# EasyEDA Pro project capDisChg_v1.eprj

# Schematic Schematic1
Board Name: Board1; Create Date: 2024-09-26
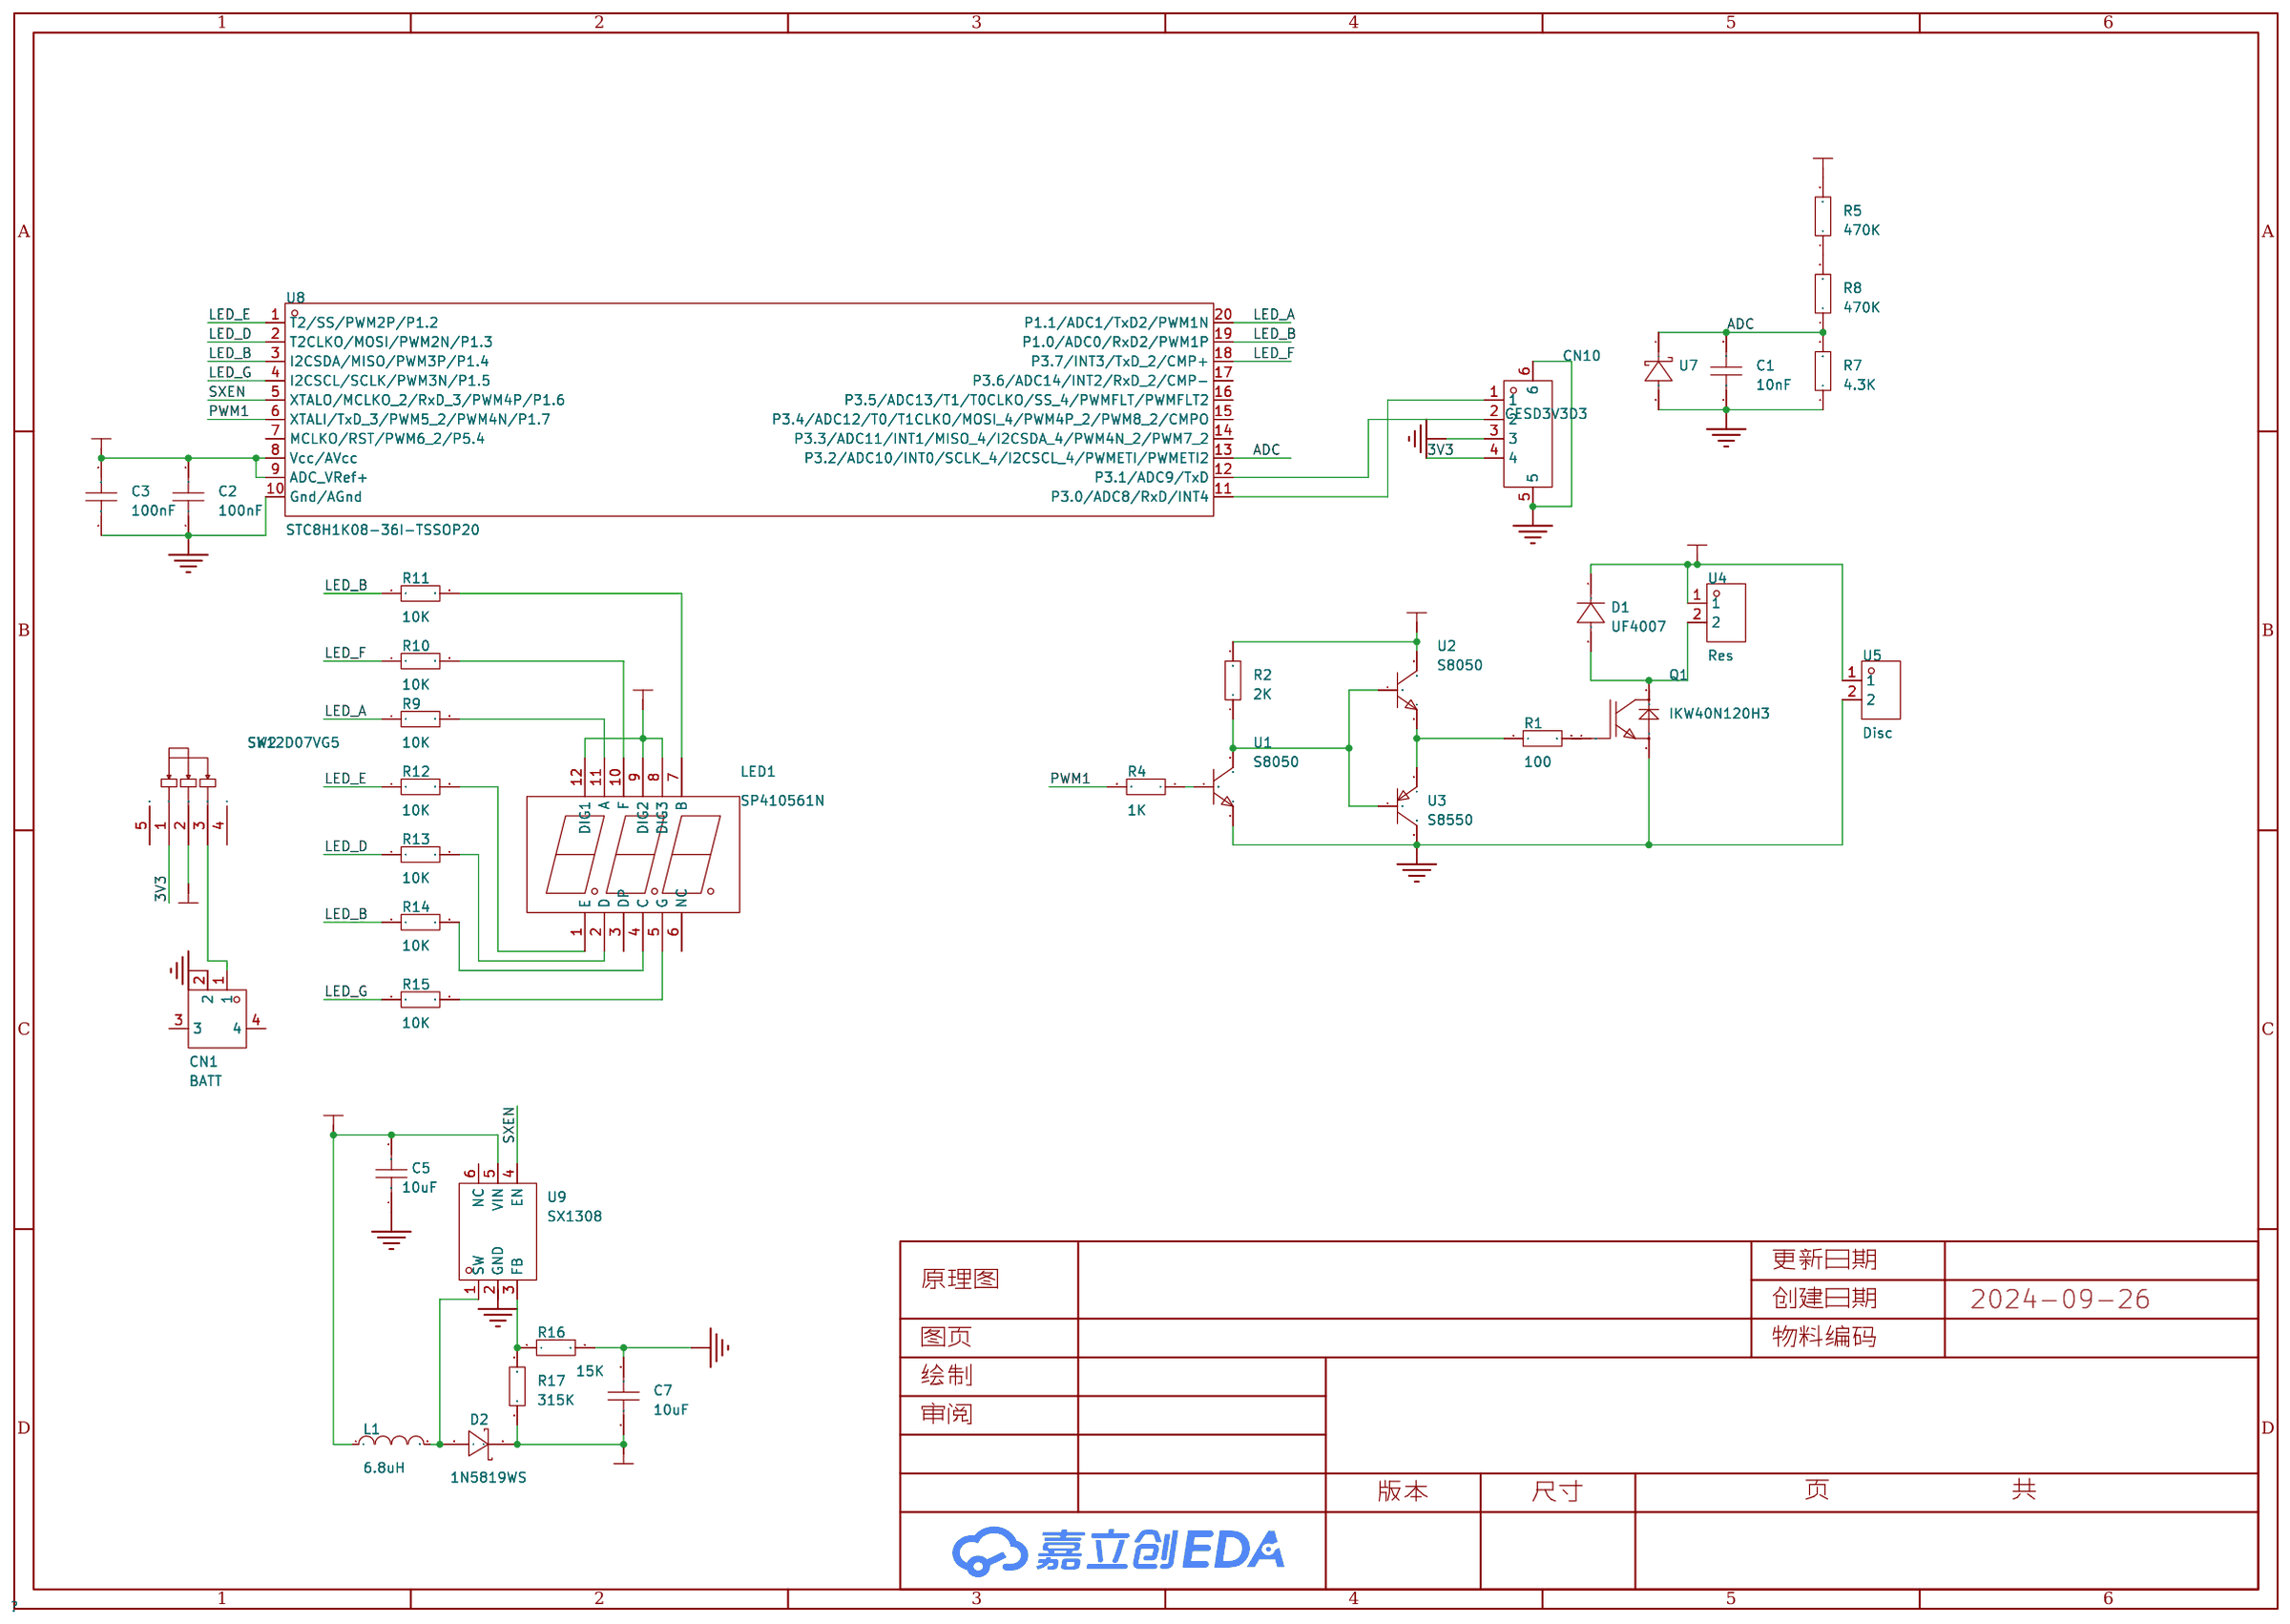
[diagram p0: schematic sheet]

## Parts
C1  10nF  [C0603]
C2  100nF  [C0603]
C3  100nF  [C0603]
C5  10uF  [C0603]
C7  10uF  [C0805]
CN1  BATT  [CONN-TH_2P-P1.25_XUNPU_WAFER-GH1.25-2PWB]
CN10  WAFER-GH1.25-4PLB  [CONN-SMD_4P-P1.25_XUNPU_WAFER-GH1.25-4PLB]
D1  UF4007  [DO-41_BD2.4-L4.7-P8.70-D0.9-RD]
D2  1N5819WS  [SOD-323_L1.8-W1.3-LS2.5-RD]
L1  6.8uH  [L1206]
LED1  SP410561N  [LED-SEG-TH_12P-L37.6-W19.0-P2.54-S15.24-BL]
Q1  IKW40N120H3  [TO-247AC-3_L15.8-W5.0-P5.46-L]
R1  100  [R0603]
R2  2K  [R0603]
R4  1K  [R0603]
R5  470K  [resis_1W_ZC_LC]
R7  4.3K  [R0603]
R8  470K  [resis_1W_ZC_LC]
R9  10K  [R0603]
R10  10K  [R0603]
R11  10K  [R0603]
R12  10K  [R0603]
R13  10K  [R0603]
R14  10K  [R0603]
R15  10K  [R0603]
R16  15K  [R0603]
R17  315K  [R0603]
SW2  SK12D07VG5  [SW-TH_SK12D07VG5]
U1  S8050  [SOT-23-3_L2.9-W1.3-P1.90-LS2.3-BR]
U2  S8050  [SOT-23-3_L2.9-W1.3-P1.90-LS2.3-BR]
U3  S8550  [SOT-23-3_L2.9-W1.3-P1.90-LS2.4-BR]
U4  Res  [CONN-TH_VH3.96-3A2]
U5  Disc  [CONN-TH_VH3.96-3A2]
U7  CESD3V3D3  [SOD-523_L1.2-W0.8-LS1.6-RD]
U8  STC8H1K08-36I-TSSOP20  [TSSOP-20_L6.5-W4.4-P0.65-LS6.4-BL]
U9  SX1308  [SOT-23-6_L2.9-W1.6-P0.95-LS2.8-BL]

## Library data of the parts
C1-C3 C5 = CAP_0603: Supplier Footprint: 0603
C7 = CAP_0805: Supplier Footprint: 0805
CN1 = WAFER-GH1.25-2PWB: LCSC Part Name: 1x2P 间距:1.25mm 卧贴 系列:GH; Supplier Part: C3029377; Manufacturer: XUNPU(讯普); Supplier Footprint: SMD,P=1.25mm,卧贴; JLCPCB Part Class: 扩展库; Datasheet: https://atta.szlcsc.com/upload/public/pdf/source/20220527/CB8773BFB0913C3B8ABD62CB38BA101A.pdf; Supplier: LCSC; Pins Structure: 1x2P; Pitch: 1.25mm; Mounting Style: 卧贴; Reference Series: GH; Number of Pins: 2P; Number of Rows: 1; Number of PINs Per Row: 2; Current Rating (Max): 1A; Operating Temperature Range: -25℃~+85℃
CN10 = WAFER-GH1.25-4PLB: LCSC Part Name: 1x4P 间距:1.25mm 立贴 系列:GH; Supplier Part: C3029370; Manufacturer: XUNPU(讯普); Supplier Footprint: SMD,P=1.25mm; JLCPCB Part Class: Extended Part; Datasheet: https://atta.szlcsc.com/upload/public/pdf/source/20220527/44F824AAC8C2B617205E15955FF9C23D.pdf; Supplier: LCSC; Pins Structure: 1x4P; Pitch: 1.25mm; Mounting Style: 立贴; Reference Series: GH; Number of Pins: 4P; Number of Rows: 1; Number of PINs Per Row: 4; Current Rating (Max): 1A; Operating Temperature Range: -25℃~+85℃
D1 = UF4007_C960666: LCSC Part Name: 电压:1kV 电流:1A; Supplier Part: C960666; Manufacturer: MDD(辰达半导体); Supplier Footprint: DO-41; JLCPCB Part Class: 扩展库; Datasheet: https://atta.szlcsc.com/upload/public/pdf/source/20230823/1B30A65DCB3ACA14005A2F03886CEF7C.pdf; Supplier: LCSC; Forward Voltage (Vf@If): 1.7V@1A; Reverse Voltage (Vr): 1kV; Rectified Current: 1A; Reverse Leakage Current: 5uA@1kV; Reverse Recovery Time (trr): 75ns; Operating Temperature: -50℃~+150℃@(Tj)
D2 = 1N5819WS_C191023: LCSC Part Name: 电压:40V 电流:1A; Supplier Part: C191023; Manufacturer: Hottech(合科泰); Supplier Footprint: SOD-323; JLCPCB Part Class: Basic Part; Datasheet: https://atta.szlcsc.com/upload/public/pdf/source/20220428/3CB86FD8D28D653594B4E35F9D5AEFD9.pdf; Supplier: LCSC; Forward Voltage (Vf@If): 600mV@1A; Reverse Voltage (Vr): 40V; Average Rectified Current (Io): 1A
L1 = L_1206
LED1 = SP410561N: LCSC Part Name: 3位0.56英寸红色数码管 共阳极; Supplier Part: C98924; Manufacturer: ARKLED(方舟); Supplier Footprint: 插件; JLCPCB Part Class: 扩展库; Datasheet: https://atta.szlcsc.com/upload/public/pdf/source/20180620/C98924_8B6F6D234E67B3F37673B777B8AFD976.pdf; Supplier: LCSC; Number of Characters: 3位; Luminous Color: 红色; LED Polarity: 共阳极; Digit/Alpha Size(inch): 0.56
Q1 = IKW40N120H3: Supplier Part: C94637; Manufacturer: Infineon(英飞凌); Supplier Footprint: TO-247AC-3; JLCPCB Part Class: Extended Part; Datasheet: https://atta.szlcsc.com/upload/public/pdf/source/20170211/1486806283981.pdf; Supplier: LCSC
R1 R2 R4 R5 R7-R17 = Res_0603: Supplier Footprint: 0603
SW2 = SK12D07VG5: LCSC Part Name: 两档位卧式拨动开关,柄长5MM; Supplier Part: C431548; Manufacturer: SHOU HAN(首韩); Supplier Footprint: 插件; JLCPCB Part Class: 扩展库; Datasheet: https://atta.szlcsc.com/upload/public/pdf/source/20190925/C431548_D6571AEBDE139FDB1E6F8A4B1513A630.pdf; Supplier: LCSC; Circuit: 单刀双掷; Pin Style: PC引脚; Switch Length: 8.7mm; Switch Width: 4.4mm; Switch Height: 4.7mm; Mounting Style: 侧插; Current Rating (DC): 500mA; Voltage Rating (DC): 50V; Mechanical Life: 5千次; Operating Temperature: -10℃~+50℃
U1 U2 = S8050_C20069125: LCSC Part Name: NPN 电流:500mA 耐压:25V; Supplier Part: C20069125; Manufacturer: 宏迦橙; Supplier Footprint: SOT-23; JLCPCB Part Class: 扩展库; Datasheet: https://atta.szlcsc.com/upload/public/pdf/source/20240403/2D78449C96B6E27F13BF8BDF79E27159.pdf; Supplier: LCSC; Transistor Type: NPN; Collector Current (Ic): 500mA; Collector-Emitter Breakdown Voltage (Vceo): 25V; Power Dissipation (Pd): 300mW; DC Current Gain (hFE@Ic,Vce): 120@50mA,1.0V; Transition Frequency (fT): 100MHz; Collector Cut-Off Current (Icbo): 100nA; Collector-Emitter Saturation Voltage (VCE(sat)@Ic,Ib): 600mV@500mA,50mA; Operating Temperature: -55℃~+150℃
U3 = S8550_C20069126: LCSC Part Name: PNP 电流:500mA 耐压:25V; Supplier Part: C20069126; Manufacturer: 宏迦橙; Supplier Footprint: SOT-23; JLCPCB Part Class: Extended Part; Datasheet: https://atta.szlcsc.com/upload/public/pdf/source/20231229/A44F382554E15234B24C32D7C3971EED.pdf; Supplier: LCSC; Transistor Type: PNP; Collector Current (Ic): 500mA; Collector-Emitter Breakdown Voltage (Vceo): 25V; Power Dissipation (Pd): 300mW; DC Current Gain (hFE@Ic,Vce): 120@500mA,1.0V; Transition Frequency (fT): 150MHz; Collector Cut-Off Current (Icbo): 100nA; Collector-Emitter Saturation Voltage (VCE(sat)@Ic,Ib): 500mV@1.0A,50mA; Operating Temperature: -55℃~+150℃
U4 U5 = VH3.96-3P(2P) ZZ: LCSC Part Name: 1x3P 间距:3.96mm 直插 系列:VH; Supplier Part: C5884431; Manufacturer: SHOU HAN(首韩); Supplier Footprint: 插件,P=3.96mm; JLCPCB Part Class: 扩展库; Datasheet: https://atta.szlcsc.com/upload/public/pdf/source/20230506/E8E7E8C8F22F3A8211E3BB95A79C703A.pdf; Supplier: LCSC; Pins Structure: 1x3P; Pitch: 3.96mm; Mounting Style: 直插; Reference Series: VH; Number of Pins: 3P; Number of Rows: 1; Number of PINs Per Row: 3; Row Spacing: 3.96mm; Current Rating (Max): 7A; Contact Material: 黄铜; Contact Plating: 锡; Operating Temperature Range: -25℃~+85℃
U7 = CESD3V3D3: Supplier Part: C20611855; Manufacturer: TECH PUBLIC(台舟); Supplier Footprint: SOD-523; JLCPCB Part Class: 扩展库; Datasheet: https://atta.szlcsc.com/upload/public/pdf/source/20240202/14995538BD672E25ECFCF906B3A58F3F.pdf; Supplier: LCSC
U8 = STC8H1K08-36I-TSSOP20: LCSC Part Name: 宽电压/高速/高可靠/低功耗/强抗静电/较强抗干扰的新一代 8051 单片机; Supplier Part: C915673; Manufacturer: STC(宏晶); Supplier Footprint: TSSOP-20; JLCPCB Part Class: 扩展库; Datasheet: https://atta.szlcsc.com/upload/public/pdf/source/20230914/FE7F6A67FEB4E2D9A560A799C5B97078.pdf; Supplier: LCSC; CPU Core: 51系列; Program Storage Size: 8KB; RAM Size: 1.25KB; GPIO Ports Number: 17; Operating Voltage Range: 1.9V~5.5V; Program Memory Type: FLASH; Operating Temperature Range: -40℃~+85℃; ADC (Bit): 10bit; PWM (Bit): 16bit; 16Bit Timer: 3; UART/USART: 2; I2C: 1; SPI: 1; Internal Comparator: 有; Peripheral/Function: 低电压检测；看门狗；CCP捕获/比较; Watchdog: 有; Low-Voltage Detect: 有; CCP Capture/Compare: 有
U9 = SX1308: Supplier Part: C78162; Manufacturer: SX(硕芯科技); Supplier Footprint: SOT-23-6; JLCPCB Part Class: Extended Part; Datasheet: https://atta.szlcsc.com/upload/public/pdf/source/20160920/1474356679185.pdf; Supplier: LCSC; Function: 升压型; Input Voltage: 2V~24V; Output Voltage: 28V; Switching Frequency: 1.2MHz; Synchronous Rectification: 否; Number of Outputs: 1; Topology: 升压式; Switch tube (built-in/external): 内置

## Nets
3V3: CN10.4 SW2.1
+12V: C7.1 D2.1(K) R2.2 R17.1 U2.3(C)
GND: C1.1 C2.1 C3.1 C5.1 C7.2 CN1.2 CN10.3 CN10.5 CN10.6 Q1.3(E) R7.1 R16.2 U1.2(E) U3.3(C) U5.2 U7.2 U8.10(Gnd/AGnd) U9.2(GND)
VBUS+: D1.1(K) R5.2 U4.1 U5.1
ADC: C1.2 R7.2 R8.1 U7.1 U8.13(P3.2/ADC10/INT0/SCLK_4/I2CSCL_4/PWMETI/PWMETI2)
LED_A: R9.1 U8.20(P1.1/ADC1/TxD2/PWM1N)
LED_B: R11.1 R14.1 U8.3(I2CSDA/MISO/PWM3P/P1.4) U8.19(P1.0/ADC0/RxD2/PWM1P)
LED_D: R13.1 U8.2(T2CLKO/MOSI/PWM2N/P1.3)
LED_E: R12.1 U8.1(T2/SS/PWM2P/P1.2)
LED_F: R10.1 U8.18(P3.7/INT3/TxD_2/CMP+)
LED_G: R15.1 U8.4(I2CSCL/SCLK/PWM3N/P1.5)
MCU_VCC: C2.2 C3.2 C5.2 L1.1 LED1.8(DIG3) LED1.9(DIG2) LED1.12(DIG1) SW2.2 U8.8(Vcc/AVcc) U8.9(ADC_VRef+) U9.5(VIN)
PWM1: R4.2 U8.6(XTALI/TxD_3/PWM5_2/PWM4N/P1.7)
SXEN: U8.5(XTALO/MCLKO_2/RxD_3/PWM4P/P1.6) U9.4(EN)
$1N222: Q1.1(G) R1.2
$1N351: R2.1 U1.3(C) U2.1(B) U3.1(B)
$1N515: R1.1 U2.2(E) U3.2(E)
$1N653: R4.1 U1.1(B)
$1N827: D1.2(A) Q1.2(C) U4.2
$1N1439: R5.1 R8.2
$1N2495: LED1.11(A) R9.2
$1N2500: LED1.10(F) R10.2
$1N2506: LED1.7(B) R11.2
$1N2512: LED1.1(E) R12.2
$1N2518: LED1.2(D) R13.2
$1N2550: LED1.4(C) R14.2
$1N2580: LED1.5(G) R15.2
$1N3029: D2.2(A) L1.2 U9.1(SW)
$1N3151: R16.1 R17.2 U9.3(FB)
$1N3739: CN10.2 U8.12(P3.1/ADC9/TxD)
$1N3745: CN10.1 U8.11(P3.0/ADC8/RxD/INT4)
$1N4939: CN1.1 SW2.3

Not connected (* = marked no-connect by the designer): CN1 3 4; LED1 3(DP) 6(NC); SW2 4 5; U8 7(MCLKO/RST/PWM6_2/P5.4) 14(P3.3/ADC11/INT1/MISO_4/I2CSDA_4/PWM4N_2/PWM7_2) 15(P3.4/ADC12/T0/T1CLKO/MOSI_4/PWM4P_2/PWM8_2/CMPO) 16(P3.5/ADC13/T1/T0CLKO/SS_4/PWMFLT/PWMFLT2) 17(P3.6/ADC14/INT2/RxD_2/CMP-); U9 6(NC)

# Board PCB1
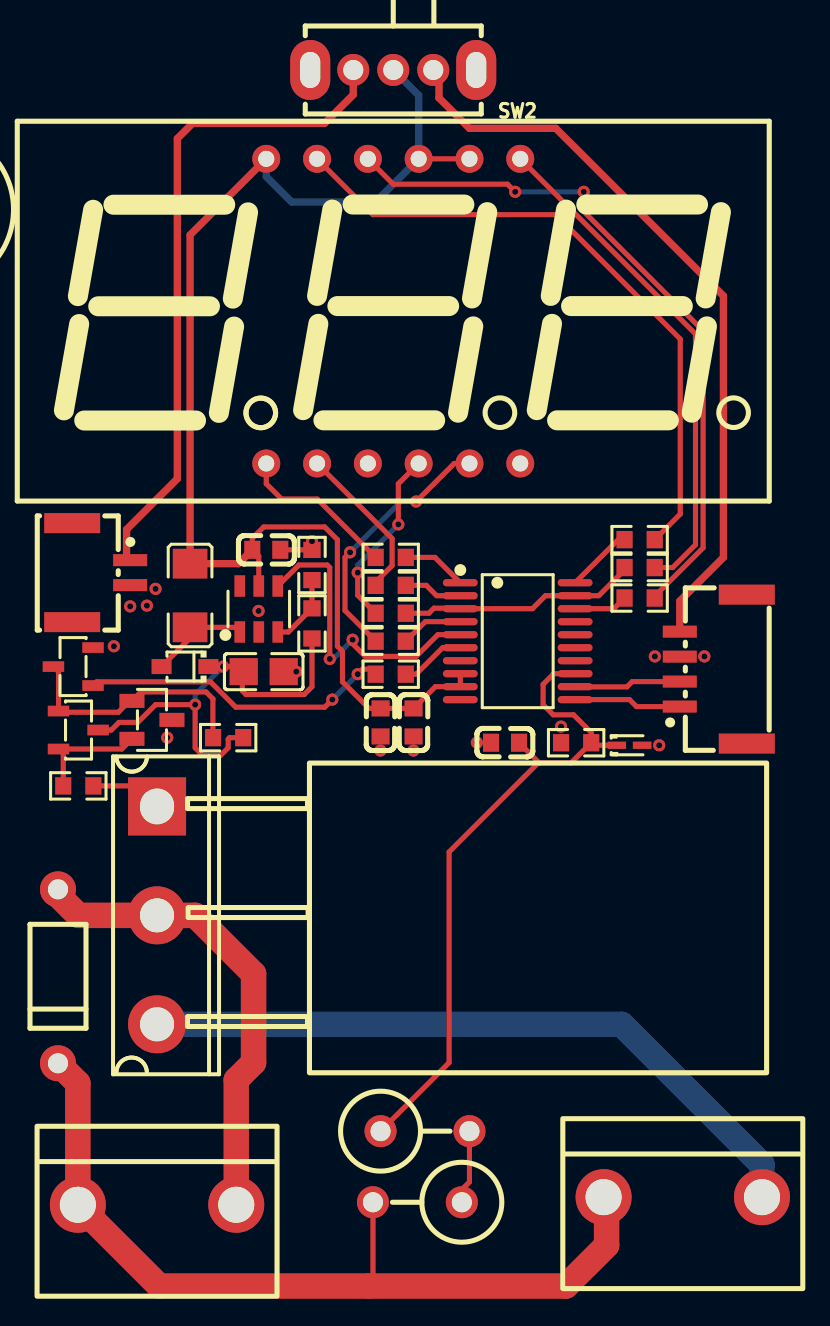
[diagram p1: board, top side]
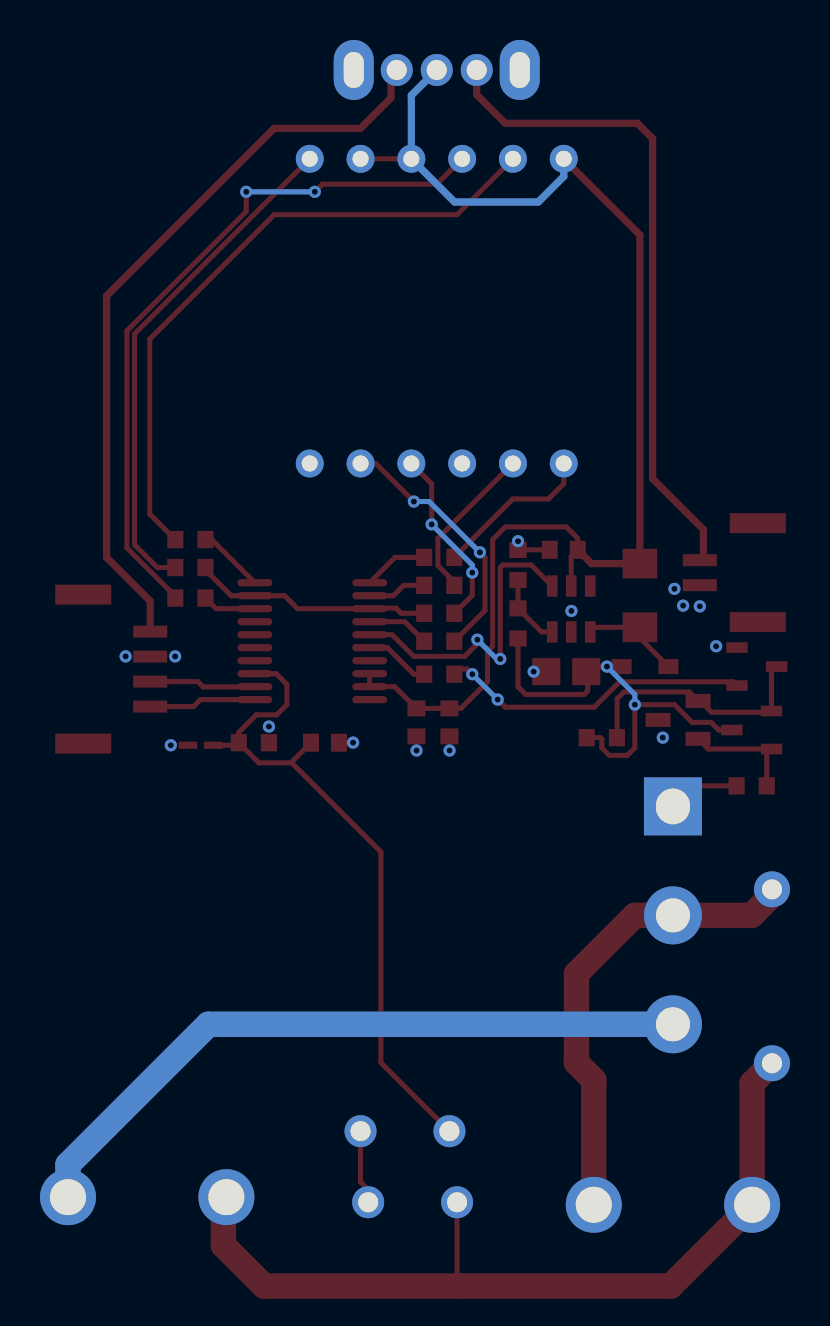
[diagram p2: board, bottom side, seen from below]

No outline. copper layers: Top Layer, Bottom Layer. Coordinates in mm from the lowest, leftmost part position.
Stack: Top Layer 0.035mm / Dielectric1 1.51mm FR4 er 4.5 / Bottom Layer 0.035mm

## Design rules (mm)
template: 自定义配置
spacing copperThickness1oz (default): track to track 0.127, other pairs 0.152 to 0.3
spacing copperThickness2oz: track to track 0.203, other pairs 0.152 to 0.3
track width copperThickness1oz (default): min 0.127, default 0.254, max 2.54
track width copperThickness2oz: min 0.203, default 0.254, max 2.54
differential pair differentialPair (default): width min 0.127, default 0.254, max 2.54; gap min 0.152, default 0.152
via viaSize (default): diameter min 0.5, default 0.61, max 10; hole min 0.3, default 0.305, max 6.3

## Placement (name value [footprint] x y rotation side)
C1  10nF  [C0603]  22.35 23.11 0 top
C2  100nF  [C0603]  16.13 24.13 90 top
C3  100nF  [C0603]  17.78 24.13 90 top
C5  10uF  [C0603]  10.41 32.77 180 top
C7  10uF  [C0805]  10.29 26.67 0 top
CN1  BATT  [CONN-TH_2P-P1.25_XUNPU_WAFER-GH1.25-2PWB]  2.16 31.62 270 top
CN10  WAFER-GH1.25-4PLB  [CONN-SMD_4P-P1.25_XUNPU_WAFER-GH1.25-4PLB]  32.77 26.8 90 top
D1  UF4007  [DO-41_BD2.4-L4.7-P8.70-D0.9-RD]  0 11.43 90 top
D2  1N5819WS  [SOD-323_L1.8-W1.3-LS2.5-RD]  6.35 26.92 180 top
L1  6.8uH  [L1206]  6.6 30.48 270 top
LED1  SP410561N  [LED-SEG-TH_12P-L37.6-W19.0-P2.54-S15.24-BL]  16.76 44.7 0 top
Q1  IKW40N120H3  [TO-247AC-3_L15.8-W5.0-P5.46-L]  4.95 14.48 270 top
R1  100  [R0603]  1.02 20.95 0 top
R2  2K  [R0603]  8.51 23.37 0 top
R4  1K  [R0603]  16.64 26.54 0 top
R5  470K  [resis_1W_ZC_LC]  20.19 0.13 180 top
R7  4.3K  [R0603]  25.91 23.11 0 top
R8  470K  [resis_1W_ZC_LC]  16.13 3.68 0 top
R9  10K  [R0603]  29.08 33.27 0 top
R10  10K  [R0603]  29.08 30.35 0 top
R11  10K  [R0603]  29.08 31.88 0 top
R12  10K  [R0603]  16.64 32.39 180 top
R13  10K  [R0603]  16.64 30.99 180 top
R14  10K  [R0603]  16.64 29.59 180 top
R15  10K  [R0603]  16.64 28.19 180 top
R16  15K  [R0603]  12.7 32 90 top
R17  315K  [R0603]  12.7 29.08 90 top
SW2  SK12D07VG5  [SW-TH_SK12D07VG5]  16.76 56.77 180 top
U1  S8050  [SOT-23-3_L2.9-W1.3-P1.90-LS2.3-BR]  0.76 26.92 0 top
U2  S8050  [SOT-23-3_L2.9-W1.3-P1.90-LS2.3-BR]  1.02 23.75 180 top
U3  S8550  [SOT-23-3_L2.9-W1.3-P1.90-LS2.4-BR]  4.7 24.26 180 top
U4  Res  [CONN-TH_VH3.96-3A2]  4.95 0 0 top
U5  Disc  [CONN-TH_VH3.96-3A2]  31.24 0.38 0 top
U7  CESD3V3D3  [SOD-523_L1.2-W0.8-LS1.6-RD]  28.57 22.99 0 top
U8  STC8H1K08-36I-TSSOP20  [TSSOP-20_L6.5-W4.4-P0.65-LS6.4-BL]  22.99 28.19 270 top
U9  SX1308  [SOT-23-6_L2.9-W1.6-P0.95-LS2.8-BL]  10.04 29.8 0 top

## Footprints (pads in the part's own frame, mm; a bottom-side part is the same pattern mirrored in y, then rotated)
C0603
  rect 0.8x0.9 smd: 1(-0.7,0) 2(0.7,0)
C0805
  rect 1.41x1.35 smd: 1(-1,0) 2(1,0)
CONN-SMD_4P-P1.25_XUNPU_WAFER-GH1.25-4PLB
  rect 0.6x1.7 smd: 1(-1.875,1.675) 2(-0.625,1.675) 3(0.625,1.675) 4(1.875,1.675)
  rect 1x2.8 smd: 5(-3.725,-1.675) 6(3.725,-1.675)
CONN-TH_2P-P1.25_XUNPU_WAFER-GH1.25-2PWB
  rect 0.6x1.7 smd: 1(-0.625,1.45) 2(0.625,1.45)
  rect 1x2.8 smd: 3(-2.475,-1.45) 4(2.475,-1.45)
CONN-TH_VH3.96-3A2
  round 2.8 hole 1.8: 1(-3.96,0) 2(3.96,0)
DO-41_BD2.4-L4.7-P8.70-D0.9-RD
  round 1.8 hole 1: 1(-4.35,0) 2(4.35,0)
L1206
  rect 1.485x1.728 smd: 1(-1.593,0) 2(1.593,0)
LED-SEG-TH_12P-L37.6-W19.0-P2.54-S15.24-BL
  round 1.4 hole 0.8: 1(-6.35,-7.62) 2(-3.81,-7.62) 3(-1.27,-7.62) 4(1.27,-7.62) 5(3.81,-7.62) 6(6.35,-7.62) 7(6.35,7.62) 8(3.81,7.62) 9(1.27,7.62) 10(-1.27,7.62) 11(-3.81,7.62) 12(-6.35,7.62)
R0603
  rect 0.806x0.864 smd: 1(-0.753,0) 2(0.753,0)
resis_1W_ZC_LC
  round 1.6 hole 1: 1(0,0) 2(4.445,0)
SOD-323_L1.8-W1.3-LS2.5-RD
  rect 1x0.75 smd: 1(-1.173,0) 2(1.173,0)
SOD-523_L1.2-W0.8-LS1.6-RD
  rect 0.93x0.36 smd: 1(-0.635,0) 2(0.635,0)
SOT-23-3_L2.9-W1.3-P1.90-LS2.3-BR
  rect 1.07x0.532 smd: 1(0.99,-0.95) 2(0.99,0.95) 3(-0.99,0)
SOT-23-3_L2.9-W1.3-P1.90-LS2.4-BR
  rect 1.25x0.7 smd: 1(1,-0.95) 2(1,0.95) 3(-1,0)
SOT-23-6_L2.9-W1.6-P0.95-LS2.8-BL
  rect 0.532x1.072 smd: 1(-0.95,-1.149) 2(0,-1.149) 3(0.95,-1.149) 4(0.95,1.149) 5(0,1.149) 6(-0.95,1.149)
SW-TH_SK12D07VG5
  oval 1.6x1.6 hole 1: 1(-2,0) 2(0,0) 3(2,0)
  oval 2x3 hole 1x1.8: 4(4.15,0) 5(-4.15,0)
TO-247AC-3_L15.8-W5.0-P5.46-L
  rect 2.9x2.9 hole 1.785x1.7: 1(-5.45,0)
  round 2.9 hole 1.7: 2(0,0) 3(5.45,0)
TSSOP-20_L6.5-W4.4-P0.65-LS6.4-BL
  oval 0.364x1.742 smd: 1(-2.925,-2.871) 2(-2.275,-2.871) 3(-1.625,-2.871) 4(-0.975,-2.871) 5(-0.325,-2.871) 6(0.325,-2.871) 7(0.975,-2.871) 8(1.625,-2.871) 9(2.275,-2.871) 10(2.925,-2.871) 11(2.925,2.871) 12(2.275,2.871) 13(1.625,2.871) 14(0.975,2.871) 15(0.325,2.871) 16(-0.325,2.871) 17(-0.975,2.871) 18(-1.625,2.871) 19(-2.275,2.871) 20(-2.925,2.871)

## Nets
As in the schematic.

Pads without a net: CN1 3 4; LED1 3 6; SW2 4 5; U8 7 14 15 16 17; U9 6

## Via types
v1: diameter 0.61, hole 0.305, Top Layer to Bottom Layer, 27 vias

## Routing (per net, layer and track width the routed paths; a pad name or vN(x,y) marks a point on that pad's centre or on a via; arc(x,y) is an arc through that point)
3V3: length 37.5
  Top Layer w0.363: CN10.4 31.09,30.2 33.27,32.39 33.27,45.47 24.89,53.85 20.57,53.85 19.05,55.37 19.05,56.48 SW2.1
+12V: length 22.2
  Top Layer w0.254: R17.1 12.7,25.92 12.31,25.53 9.4,25.53 9.22,25.71 9.22,26.6 C7.1 9.03,26.92 v1(8.25,26.92) D2.1 ; U2.3 2.67,23.75 3.05,24.13 3.99,24.13 4.88,25.02 v1(6.86,25.02) 6.86,22.86 7.24,22.48 8.13,22.48 8.51,22.86 8.51,23.3 8.58,23.37 R2.2
  Bottom Layer w0.254: v1(6.86,25.02) 6.86,25.53 v1(8.25,26.92)
GND: length 36.4
  Top Layer w0.254: C5.1 12.69,32.77 R16.2
  Bottom Layer w1.27: Q1.3 28.18,9.03 35.2,2.01 U5.2
  vias: v1(2.79,27.94) v1(3.61,29.94) v1(4.44,29.97) v1(4.88,30.81) v1(5.46,23.37) v1(10.03,29.71) v1(11.92,26.67) v1(12.7,33.2) v1(16.12,22.72) v1(17.77,22.72) v1(20.95,23.12) v1(25.15,23.92) v1(29.84,27.43) v1(30.06,22.99) v1(32.32,27.43)
VBUS+: length 43.8
  Top Layer w0.254: 15.75,0.76 15.75,-3.84 15.52,-4.06
  Top Layer w1.27: D1.1 0.99,6.09 U4.1 5.06,-4.06 25.4,-4.06 27.43,-2.03 27.43,0.23 U5.1
ADC: length 33.8
  Top Layer w0.254: R7.2 26.79,22.99 U7.1 ; R7.2 26.66,23.63 25.78,24.51 24.76,24.51 24.26,25.02 24.26,26.03 24.79,26.57 U8.13 ; R7.2 25.65,22.11 24.06,22.11 ; 24.06,22.11 24.01,22.11 19.56,17.65 19.56,7.11 R8.1 ; 24.06,22.11 C1.2
LED_A: length 3.4
  Top Layer w0.254: U8.20 28.01,33.27 R9.1
LED_B: length 12
  Top Layer w0.254: R11.1 28.33,31.76 27.04,30.47 U8.19 24.37,30.47 23.72,29.82 U8.3 20.09,29.84 18.8,29.84 18.54,29.59 R14.1
LED_D: length 2.9
  Top Layer w0.254: R13.1 18.41,30.99 18.93,30.47 U8.2
LED_E: length 3.2
  Top Layer w0.254: U8.1 18.85,32.39 R12.1
LED_F: length 2.7
  Top Layer w0.254: U8.18 27.8,29.82 R10.1
LED_G: length 3.1
  Top Layer w0.254: R15.1 18.37,29.17 U8.4
MCU_VCC: length 64.7
  Top Layer w0.254: U8.8 U8.9 18.87,25.92 C3.2 C2.2 15.56,24.83 14.22,26.16 14.22,27.69 13.97,27.94 13.97,33.27 13.33,33.91 10.29,33.91 9.71,33.34 C5.2 10.04,32.44 U9.5 ; LED1.8 LED1.9
  Top Layer w0.363: C5.2 9.02,32.07 L1.1 6.6,48.51 LED1.12
  Bottom Layer w0.363: LED1.12 10.41,51.44 11.68,50.17 15.88,50.17 LED1.9 18.03,55.5 SW2.2
PWM1: length 3.3
  Top Layer w0.254: R4.2 17.91,26.54 19.23,27.87 U8.6
SXEN: length 15.5
  Top Layer w0.254: v1(13.59,27.31) 13.59,31.88 13.46,32 12.04,32 U9.4 ; v1(14.73,28.27) 14.73,28.07 15.37,27.43 17.91,27.43 18.99,28.52 U8.5
  Bottom Layer w0.254: v1(13.59,27.31) 13.77,27.31 v1(14.73,28.27)
$1N222: length 3.6
  Top Layer w0.254: R1.2 3.93,20.95 Q1.1
$1N351: length 12.6
  Top Layer w0.254: R2.1 7.75,23.38 7.75,25.31 7.4,25.65 4.15,25.65 U3.1 3.59,25.21 3.02,24.64 0.09,24.64 U2.1 0.03,26.67 U1.3
$1N515: length 5.8
  Top Layer w0.254: U3.2 3.19,22.8 U2.2 0.26,22.56 R1.1
$1N653: length 15.5
  Top Layer w0.254: v1(13.72,25.27) 13.33,24.89 8.89,24.89 7.62,26.16 1.94,26.16 U1.1 ; 15.88,26.8 15.24,26.8 v1(14.99,26.54)
  Bottom Layer w0.254: v1(13.72,25.27) v1(14.99,26.54)
$1N827: length 23.6
  Top Layer w1.27: 8.91,0 8.91,6.25 9.78,7.11 9.78,11.56 6.86,14.48 Q1.2 1.02,14.48 0,15.49 D1.2
$1N1439: length 4.3
  Top Layer w0.254: R5.1 20.19,0.76 20.57,1.14 20.57,4.32
$1N2495: length 32.5
  Top Layer w0.254: R9.2 31.11,34.55 31.11,43.31 24.89,49.53 15.75,49.53 LED1.11
$1N2500: length 35.3
  Top Layer w0.254: v1(22.86,50.67) 22.48,51.05 16.76,51.05 LED1.10 ; v1(26.29,50.67) 26.29,49.69 32.26,43.72 32.26,32.86 29.84,30.44 R10.2
  Bottom Layer w0.254: v1(26.29,50.67) v1(22.86,50.67)
$1N2506: length 25.4
  Top Layer w0.254: LED1.7 31.88,43.56 31.88,33.02 30.73,31.88 R11.2
$1N2512: length 8
  Top Layer w0.254: LED1.1 10.41,36.07 11.18,35.31 12.96,35.31 R12.2
$1N2518: length 8
  Top Layer w0.254: R13.2 15.88,31.16 16.71,31.98 16.71,33.33 LED1.2
$1N2550: length 9.1
  Top Layer w0.254: v1(14.99,31.62) 14.99,30.49 R14.2 ; v1(17.02,34.04) 17.02,36.07 LED1.4
  Bottom Layer w0.254: v1(17.02,34.04) 14.99,32 v1(14.99,31.62)
$1N2580: length 13
  Top Layer w0.254: v1(14.6,32.64) 14.35,32.39 14.35,29.73 R15.2 ; LED1.5 19.81,37.08 v1(17.91,35.18)
  Bottom Layer w0.254: v1(17.91,35.18) 17.14,35.18 v1(14.6,32.64)
$1N3029: length 5.1
  Top Layer w0.254: D2.2 6.6,28.35 L1.2 8.86,28.89 U9.1
$1N3151: length 3.6
  Top Layer w0.254: R16.1 R17.2 11.52,28.66 U9.3
$1N3739: length 5.3
  Top Layer w0.254: CN10.2 28.71,26.17 28.45,25.91 25.87,25.91 U8.12
$1N3745: length 5.4
  Top Layer w0.254: CN10.1 28.93,24.92 28.57,25.27 25.86,25.27 U8.11
$1N4939: length 33.4
  Top Layer w0.363: SW2.3 14.76,55.53 13.33,54.1 6.73,54.1 5.97,53.34 5.97,36.32 3.43,33.78 3.43,32.26 3.71,32.26
